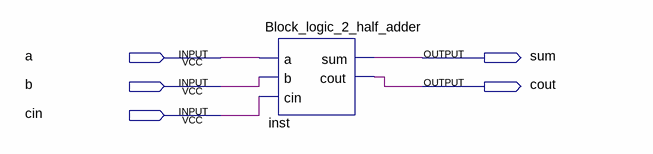
[diagram p0: schematic sheet]
// Quartus schematic Block2_Full_adder.bdf as structural Verilog: 1 symbols, 5 pins
module Block2_Full_adder (
  input  a,
  input  b,
  input  cin,
  output sum,
  output cout
);

  Block_logic_2_half_adder inst (.a(a), .b(b), .cin(cin), .sum(sum), .cout(cout));
endmodule
